# Altium project POwerManager.PrjPCB
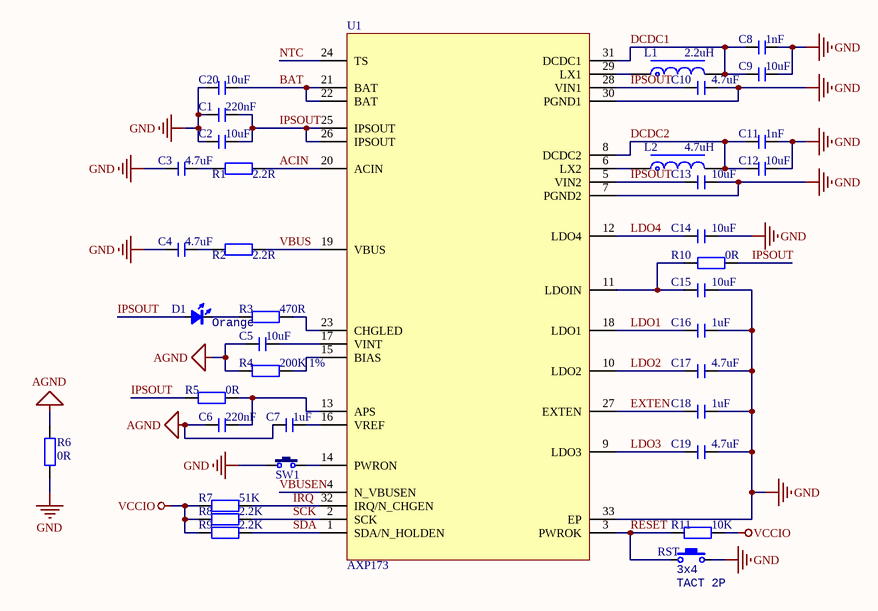
[diagram p0: PMU.SchDoc]
3 sheets, 68 parts. Net scope: global (net labels, ports and power ports of the same name join across sheets).
Board file: PowerManager.PcbDoc
Sheets:
  PMU.SchDoc
  Connector.SchDoc
  MCU.SchDoc

## Sheet PMU.SchDoc
size A4

### Parts
(Parts that share a designator on the sheet are numbered #1, #2 ... from top to bottom, then left to right.)
C1  220nF  [C 0603_L]
C2  10uF  [C 0603_L]
C3  4.7uF  [C 0603_L]
C4  4.7uF  [C 0603_L]
C5  10uF  [C 0603_L]
C6  220nF  [C 0603_L]
C7  1uF  [C 0603_L]
C8  1nF  [C 0603_L]
C9  10uF  [C 0805_L]
C10  4.7uF  [C 0603_L]
C11  1nF  [C 0603_L]
C12  10uF  [C 0805_L]
C13  10uF  [C 0603_L]
C14  10uF  [C 0603_L]
C15  10uF  [C 0603_L]
C16  1uF  [C 0603_L]
C17  4.7uF  [C 0603_L]
C18  1uF  [C 0603_L]
C19  4.7uF  [C 0603_L]
C20  10uF  [C 0603_L]
D1  Orange  [LED_0603_ORANGE]
L1  2.2uH  [NR3015]
L2  4.7uH  [NR4030]
R1  2.2R  [R 0603_L]
R2  2.2R  [R 0603_L]
R3  470R  [R 0603_L]
R4  200K 1%  [R 0603_L]
R5  0R  [R 0603_L]
R6  0R  [R 0603_L]
R7  51K  [R 0603_L]
R8  2.2K  [R 0603_L]
R9  2.2K  [R 0603_L]
R10  0R  [R 0603_L]
R11  10K  [R 0603_L]
RST  value 3x4  [ButtonTACT_3x4x2_180]  (hidden comment: TACT 2P)
SW1#1  3x6x5  [TSW 3*6*4.3-S-W]  (value not drawn)
U1  AXP173  [QFN32 5x5_L]

### Nets
ACIN: R1.2 U1.20(ACIN)
AGND: C5.2 C6.2 C7.2 R4.2 R6.2
DCDC1: C8.2 C9.1 L1.2 U1.31(DCDC1)
DCDC2: C11.2 C12.1 L2.2 U1.8(DCDC2)
GND: C1.1 C2.1 C3.1 C4.1 C8.1 C9.2 C10.2 C11.1 C12.2 C13.2 C14.2 C15.2 C16.2 C17.2 C18.2 C19.2 C20.1 R6.1 RST.2 SW1#1.1 U1.7(PGND2) U1.30(PGND1) U1.33(EP)
LDO1: C16.1 U1.18(LDO1)
LDO2: C17.1 U1.10(LDO2)
LDO3: C19.1 U1.9(LDO3)
LDO4: C14.1 U1.12(LDO4)
VBUS: R2.2 U1.19(VBUS)
VCCIO: R7.2 R8.2 R9.2 R11.1
BAT: C20.2 U1.21(BAT) U1.22(BAT)
EXTEN: C18.1 U1.27(EXTEN)
IPSOUT: C1.2 C2.2 C10.1 C13.1 D1.1(A) R5.2 R10.1 U1.5(VIN2) U1.25(IPSOUT) U1.26(IPSOUT) U1.28(VIN1)
IRQ: R7.1 U1.32(IRQ/N_CHGEN)
NTC: U1.24(TS)
RESET: R11.2 RST.1 U1.3(PWROK)
SCK: R8.1 U1.2(SCK)  [project net I2C_SCL]
SDA: R9.1 U1.1(SDA/N_HOLDEN)  [project net I2C_SDA]
VBUSEN: U1.4(N_VBUSEN)  [project net PB5]
NetC3_2: C3.2 R1.1
NetC4_2: C4.2 R2.1
NetC5_1: C5.1 U1.17(VINT)
NetC6_1: C6.1 R5.1 U1.13(APS)
NetC7_1: C7.1 U1.16(VREF)
NetC15_1: C15.1 R10.2 U1.11(LDOIN)
NetD1_2: D1.2(K) R3.1
NetL1_1: L1.1 U1.29(LX1)
NetL2_1: L2.1 U1.6(LX2)
NetR3_2: R3.2 U1.23(CHGLED)
NetR4_1: R4.1 U1.15(BIAS)
NetSW1#1_2: SW1#1.2 U1.14(PWRON)

### Library data of the parts
C1-C20 = C: 无极性贴片电容; 版权归属: 源创客; BOM名称: 无极性贴片电容; 学习资源: www.ooocke.com
D1 = LED_0603: LED; Type: 0603; Value: Orange
L1 L2 = L-NR: NR磁胶电感; 版权归属: 源创客; BOM名称: NR磁胶电感; 学习资源: www.ooocke.com
R1-R11 = R: 贴片电阻; 版权归属: 源创客; BOM名称: 贴片电阻; 学习资源: www.ooocke.com
RST = ButtonTACT_3x4x2_180: Button; type: TACT 2P
SW1#1 = TSW 3x6: 3x6轻触开关; 版权归属: 源创客; BOM名称: 3x6轻触开关; 学习资源: www.ooocke.com

## Sheet Connector.SchDoc
size A4
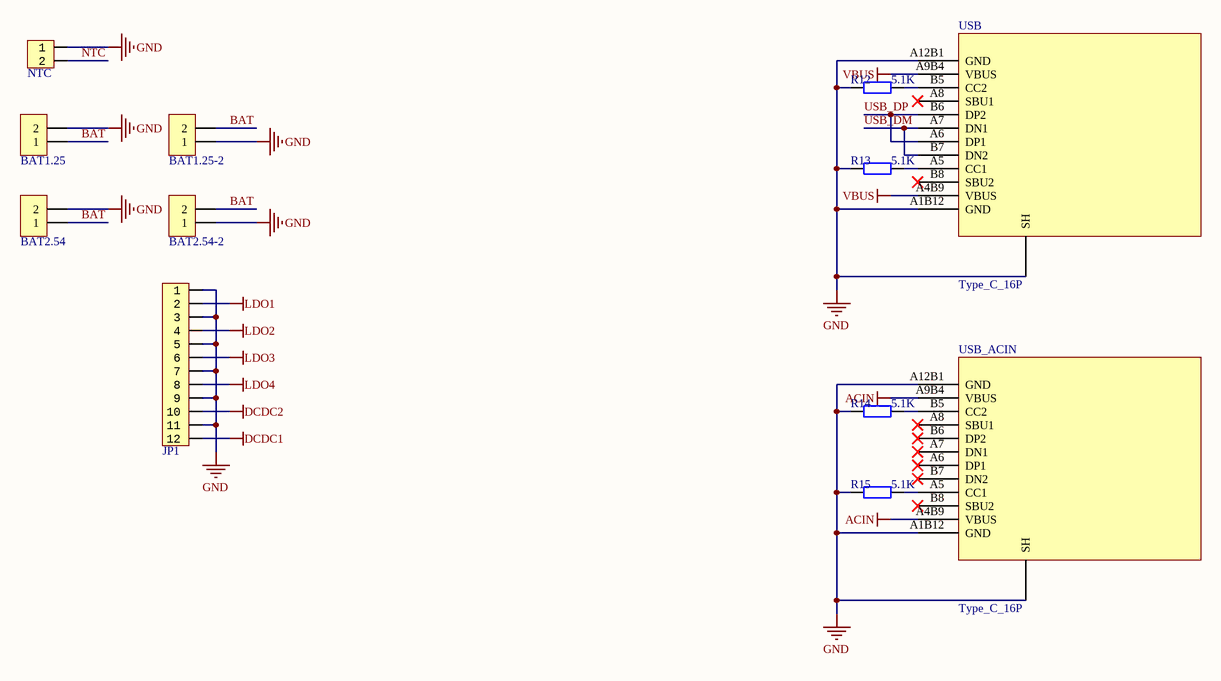
[diagram p1: Connector.SchDoc]

### Parts
BAT1.25  HDR-1X2  [MX 1.25-WS-2P]  (value not drawn)
BAT1.25-2  HDR-1X2  [MX 1.25-WS-2P]  (value not drawn)
BAT2.54  HDR-1X2  [XH2.54-WS-2P]  (value not drawn)
BAT2.54-2  HDR-1X2  [XH2.54-WS-2P]  (value not drawn)
JP1  HDR1x12_2.54T  [HDR1X12_2.54_90]  (value not drawn)
NTC  HDR1x2_1.27T  [HDR1X2_1.27_180]  (value not drawn)
R12  5.1K  [R 0603_L]
R13  5.1K  [R 0603_L]
R14  5.1K  [R 0603_L]
R15  5.1K  [R 0603_L]
USB  Type_C_16P  [Type_C_16P]
USB_ACIN  Type_C_16P  [Type_C_16P]

### Nets
ACIN: USB_ACIN.A4B9(VBUS) USB_ACIN.A9B4(VBUS)
DCDC1: JP1.12
DCDC2: JP1.10
GND: BAT1.25.2 BAT1.25-2.1 BAT2.54.2 BAT2.54-2.1 JP1.1 JP1.3 JP1.5 JP1.7 JP1.9 JP1.11 NTC.1 R12.1 R13.1 R14.1 R15.1 USB.0(SH) USB.A1B12(GND) USB.A12B1(GND) USB_ACIN.0(SH) USB_ACIN.A1B12(GND) USB_ACIN.A12B1(GND)
LDO1: JP1.2
LDO2: JP1.4
LDO3: JP1.6
LDO4: JP1.8
VBUS: USB.A4B9(VBUS) USB.A9B4(VBUS)
BAT: BAT1.25.1 BAT1.25-2.2 BAT2.54.1 BAT2.54-2.2
NTC: NTC.2
USB_DM: USB.A7(DN1) USB.B7(DN2)
USB_DP: USB.A6(DP1) USB.B6(DP2)
NetR12_2: R12.2 USB.B5(CC2)
NetR13_2: R13.2 USB.A5(CC1)
NetR14_2: R14.2 USB_ACIN.B5(CC2)
NetR15_2: R15.2 USB_ACIN.A5(CC1)

Not connected (* = marked no-connect by the designer): USB A8(SBU1)* B8(SBU2)*; USB_ACIN A6(DP1)* A7(DN1)* A8(SBU1)* B6(DP2)* B7(DN2)* B8(SBU2)*

### Library data of the parts
BAT1.25 BAT1.25-2 BAT2.54 BAT2.54-2 = Header 2: 2P接插件; 版权归属: 源创客; BOM名称: 2P接插件; 学习资源: www.ooocke.com
JP1 = HDR1x12_2.54T: Header
NTC = HDR1x2_1.27T: Header
R12-R15 = R: 贴片电阻; 版权归属: 源创客; BOM名称: 贴片电阻; 学习资源: www.ooocke.com

## Sheet MCU.SchDoc
size A4
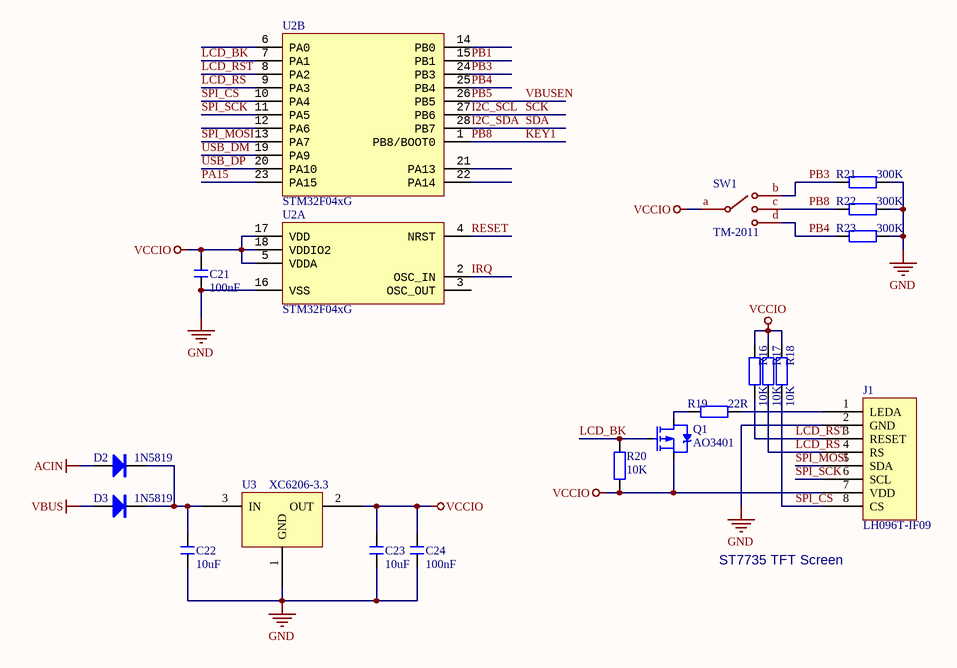
[diagram p2: MCU.SchDoc]

### Parts
(Parts that share a designator on the sheet are numbered #1, #2 ... from top to bottom, then left to right.)
C21  100nF  [C 0603_L]
C22  10uF  [C 0603_L]
C23  10uF  [C 0603_L]
C24  100nF  [C 0603_L]
D2  1N5819  [SOD-123]
D3  1N5819  [SOD-123]
J1  LH096T-IF09  [LH096T-IF09]
Q1  AO3401  [SOT23-3]
R16  10K  [R 0603_L]
R17  10K  [R 0603_L]
R18  10K  [R 0603_L]
R19  22R  [R 0603_L]
R20  10K  [R 0603_L]
R21  300K  [R 0603_L]
R22  300K  [R 0603_L]
R23  300K  [R 0603_L]
SW1#2  TM-2011  [TM-2011]
U2  STM32F04xG  [QFN_P0.5_28_NOPAD]  (parts A,B of 2)
U3  XC6206-3.3  [SOT23-3]

### Nets
ACIN: D2.1(A)
GND: C21.1 C22.2 C23.2 C24.2 J1.2(GND) R21.2 R22.2 R23.2 U2.16(VSS) U3.1(GND)
VBUS: D3.1(A)
VCCIO: C21.2 C23.1 C24.1 J1.7(VDD) Q1.2(S) R16.2 R17.2 R18.2 R20.1 SW1#2.a U2.5(VDDA) U2.17(VDD) U2.18(VDDIO2) U3.2(OUT)
I2C_SCL: U2.27(PB6)  [also labelled SCK]
I2C_SDA: U2.28(PB7)  [also labelled SDA]
IRQ: U2.2(OSC_IN)
KEY1: R22.1 SW1#2.c U2.1(PB8/BOOT0)  [also labelled PB8]
LCD_BK: Q1.1(G) R20.2 U2.7(PA1)
LCD_RS: J1.4(RS) R17.1 U2.9(PA3)
LCD_RST: J1.3(RESET) R16.1 U2.8(PA2)
PA15: U2.23(PA15)
PB1: U2.15(PB1)
PB3: R21.1 SW1#2.b U2.24(PB3)
PB4: R23.1 SW1#2.d U2.25(PB4)
PB5: U2.26(PB5)  [also labelled VBUSEN]
RESET: U2.4(NRST)
SPI_CS: J1.8(CS) R18.1 U2.10(PA4)
SPI_MOSI: J1.5(SDA) U2.13(PA7)
SPI_SCK: J1.6(SCL) U2.11(PA5)
USB_DM: U2.19(PA9)
USB_DP: U2.20(PA10)
NetC22_1: C22.1 D2.2(K) D3.2(K) U3.3(IN)
NetJ1_1: J1.1(LEDA) R19.2
NetQ1_3: Q1.3(D) R19.1

Not connected (* = marked no-connect by the designer): U2 3(OSC_OUT) 6(PA0) 12(PA6) 14(PB0) 21(PA13) 22(PA14)

### Notes on the sheet
- (near J1) ST7735 TFT Screen

### Library data of the parts
C21-C24 = C: 无极性贴片电容; 版权归属: 源创客; BOM名称: 无极性贴片电容; 学习资源: www.ooocke.com
D2 D3 = 1N4007: 整流二极管; 版权归属: 源创客; BOM名称: 整流二极管; 学习资源: www.ooocke.com
R16-R23 = R: 贴片电阻; 版权归属: 源创客; BOM名称: 贴片电阻; 学习资源: www.ooocke.com
U2 = STM32F04xG: MCU

## Nets that join several sheets
ACIN: PMU (R1.2 U1.20), Connector (USB_ACIN.A4B9 USB_ACIN.A9B4), MCU (D2.1)
DCDC1: PMU (C8.2 C9.1 L1.2 U1.31), Connector (JP1.12)
DCDC2: PMU (C11.2 C12.1 L2.2 U1.8), Connector (JP1.10)
GND: PMU (23 pins), Connector (21 pins), MCU (10 pins)
LDO1: PMU (C16.1 U1.18), Connector (JP1.2)
LDO2: PMU (C17.1 U1.10), Connector (JP1.4)
LDO3: PMU (C19.1 U1.9), Connector (JP1.6)
LDO4: PMU (C14.1 U1.12), Connector (JP1.8)
VBUS: PMU (R2.2 U1.19), Connector (USB.A4B9 USB.A9B4), MCU (D3.1)
VCCIO: PMU (R7.2 R8.2 R9.2 R11.1), MCU (14 pins)
BAT: PMU (C20.2 U1.21 U1.22), Connector (BAT1.25.1 BAT1.25-2.2 BAT2.54.1 BAT2.54-2.2)
I2C_SCL: PMU (R8.1 U1.2), MCU (U2.27)
I2C_SDA: PMU (R9.1 U1.1), MCU (U2.28)
IRQ: PMU (R7.1 U1.32), MCU (U2.2)
NTC: PMU (U1.24), Connector (NTC.2)
PB5: PMU (U1.4), MCU (U2.26)
RESET: PMU (R11.2 RST.1 U1.3), MCU (U2.4)
USB_DM: Connector (USB.A7 USB.B7), MCU (U2.19)
USB_DP: Connector (USB.A6 USB.B6), MCU (U2.20)